# EAGLE design analyzer (EAGLE 6.5.0)
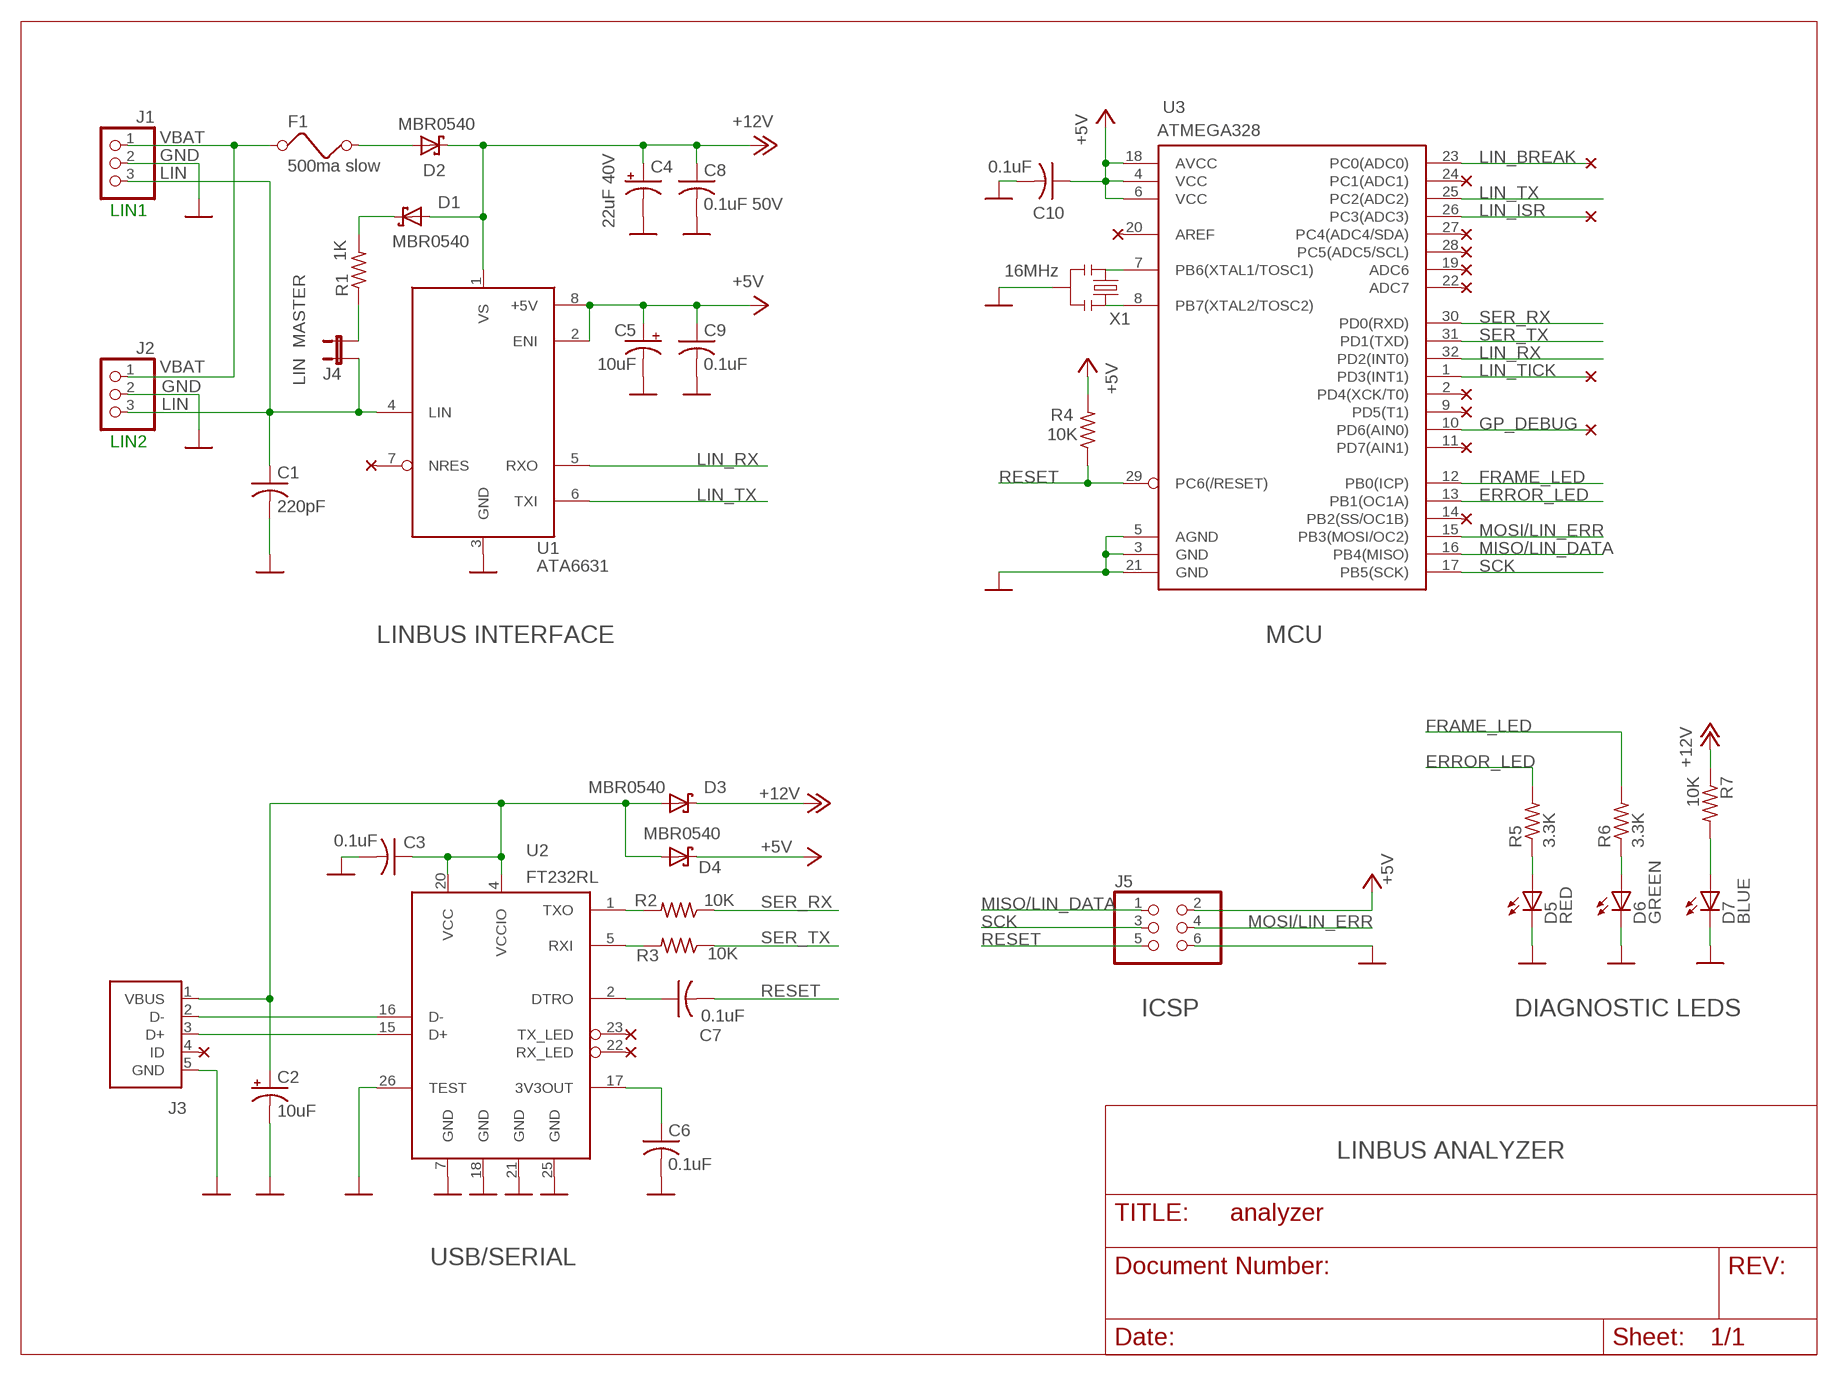
[diagram p0: schematic, sheet 1]

## Parts
C1  220pF  C-USC0805  [C0805]
C2  10uF  CPOL-USA/3216-18R  [A/3216-18R]
C3  0.1uF  C-USC0805  [C0805]
C4  22uF 40V  CPOL-USUD-6,3X5,8  [UD-6,3X5,8_NICHICON]
C5  10uF  CPOL-USA/3216-18R  [A/3216-18R]
C6  0.1uF  C-USC0805  [C0805]
C7  0.1uF  C-USC0805  [C0805]
C8  0.1uF 50V  C-USC0805  [C0805]
C9  0.1uF  C-USC0805  [C0805]
C10  0.1uF  C-USC0805  [C0805]
D1  MBR0540  SMF5.0AT1  [SOD123FL]
D2  MBR0540  SMF5.0AT1  [SOD123FL]
D3  MBR0540  SMF5.0AT1  [SOD123FL]
D4  MBR0540  SMF5.0AT1  [SOD123FL]
D5  RED  LED  [1206-LED]
D6  GREEN  LED  [1206-LED]
D7  BLUE  LED  [1206-LED]
F1  500ma slow  FUSE  [1206]
J1  PINHD-1X3  [1X03]
J2  PINHD-1X3  [1X03]
J3  USBSMD  [USB-MINIB]
J4  JP1E  [JP1]
J5  PINHD-2X3  [2X03]
R1  1K  R-US_R0805  [R0805]
R2  10K  R-US_R0805  [R0805]
R3  10K  R-US_R0805  [R0805]
R4  10K  R-US_R0805  [R0805]
R5  3.3K  R-US_R0805  [R0805]
R6  3.3K  R-US_R0805  [R0805]
R7  10K  R-US_R0805  [R0805]
U1  ATA6631  [SO-08]
U2  FT232RL  [SSOP28DB]
U3  ATMEGA328  [TQFP32-08]
X1  16MHz  RESONATORSMD  [RESONATOR-SMD]

## Nets
+5V: C5.+ C9.1 C10.1 D4.C J5.2 R4.2 U1.2(ENI) U1.8(+5V) U3.4(VCC) U3.6(VCC) U3.18(AVCC)
+12V: C4.+ C8.1 D1.A D2.C D3.C R7.1 U1.1(VS)
ERROR_LED: R5.2 U3.13(PB1(OC1A))
FRAME_LED: R6.2 U3.12(PB0(ICP))
GND: C1.2 C2.- C3.2 C4.- C5.- C6.2 C8.2 C9.2 C10.2 D5.C D6.C D7.C J1.2 J2.2 J3.5(GND) J5.6 U1.3(GND) U2.7(GND) U2.18(GND) U2.21(GND) U2.25(GND) U2.26(TEST) U3.3(GND) U3.5(AGND) U3.21(GND) X1.2
GP_DEBUG: U3.10(PD6(AIN0))
LIN: C1.1 J1.3 J2.3 J4.1 U1.4(LIN)
LIN_BREAK: U3.23(PC0(ADC0))
LIN_ISR: U3.26(PC3(ADC3))
LIN_RX: U1.5(RXO) U3.32(PD2(INT0))
LIN_TICK: U3.1(PD3(INT1))
LIN_TX: U1.6(TXI) U3.25(PC2(ADC2))
MISO/LIN_DATA: J5.1 U3.16(PB4(MISO))
MOSI/LIN_ERR: J5.4 U3.15(PB3(MOSI/OC2))
N$2: U3.8(PB7(XTAL2/TOSC2)) X1.1
N$3: D6.A R6.1
N$4: D5.A R5.1
N$5: R3.2 U2.5(RXI)
N$6: D2.A F1.2
N$7: U3.7(PB6(XTAL1/TOSC1)) X1.3
N$8: D1.C R1.2
N$9: J4.2 R1.1
N$10: J3.3(D+) U2.15(D+)
N$11: C7.1 U2.2(DTRO)
N$12: C2.+ C3.1 D3.A D4.A J3.1(VBUS) U2.4(VCCIO) U2.20(VCC)
N$13: R2.2 U2.1(TXO)
N$15: J3.2(D-) U2.16(D-)
N$16: C6.1 U2.17(3V3OUT)
N$17: D7.A R7.2
RESET: C7.2 J5.5 R4.1 U3.29(PC6(/RESET))
SCK: J5.3 U3.17(PB5(SCK))
SER_RX: R2.1 U3.30(PD0(RXD))
SER_TX: R3.1 U3.31(PD1(TXD))
VBAT: F1.1 J1.1 J2.1
Unconnected: J3.4(ID) U1.7(NRES) U2.22(RX_LED) U2.23(TX_LED) U3.2(PD4(XCK/T0)) U3.9(PD5(T1)) U3.11(PD7(AIN1)) U3.14(PB2(SS/OC1B)) U3.19(ADC6) U3.20(AREF) U3.22(ADC7) U3.24(PC1(ADC1)) U3.27(PC4(ADC4/SDA)) U3.28(PC5(ADC5/SCL))

## Notes on the sheet
- LIN1
- LIN  MASTER
- LIN2
- LINBUS INTERFACE | MCU
- ICSP | DIAGNOSTIC LEDS
- LINBUS ANALYZER
- USB/SERIAL

## Library data of the parts
C1 C3 C6-C10 = analyzer:C-US: CAPACITOR, American symbol
C2 C4 C5 = analyzer:CPOL-US
D1-D4 = analyzer:SMF5.0AT1
D5-D7 = analyzer:LED
F1 = analyzer:FUSE
J1 J2 = analyzer:PINHD-1X3
J3 = analyzer:USB: USB Connectors USB-B-PTH is fully proven SKU : PRT-00139 USB-miniB is fully proven SKU : PRT-00587 USB-A-PCB is untested. USB-A-H is throughly reviewed, but untested. Spark Fun Electronics SKU : PRT-00437 USB-B-SMT is throughly reviewed, but untested. Needs silkscreen touching up. USB-A-S has not been used/tested USB-MB-H has not been used/tested
J4 = analyzer:JP1E: JUMPER
J5 = analyzer:PINHD-2X3
R1-R7 = analyzer:R-US_: RESISTOR, American symbol
U1 = analyzer:ATA6631
U2 = analyzer:FT232RL
U3 = analyzer:ATMEGA328
X1 = analyzer:RESONATOR

## Net classes
1 power: width 0.254 mm

## Board
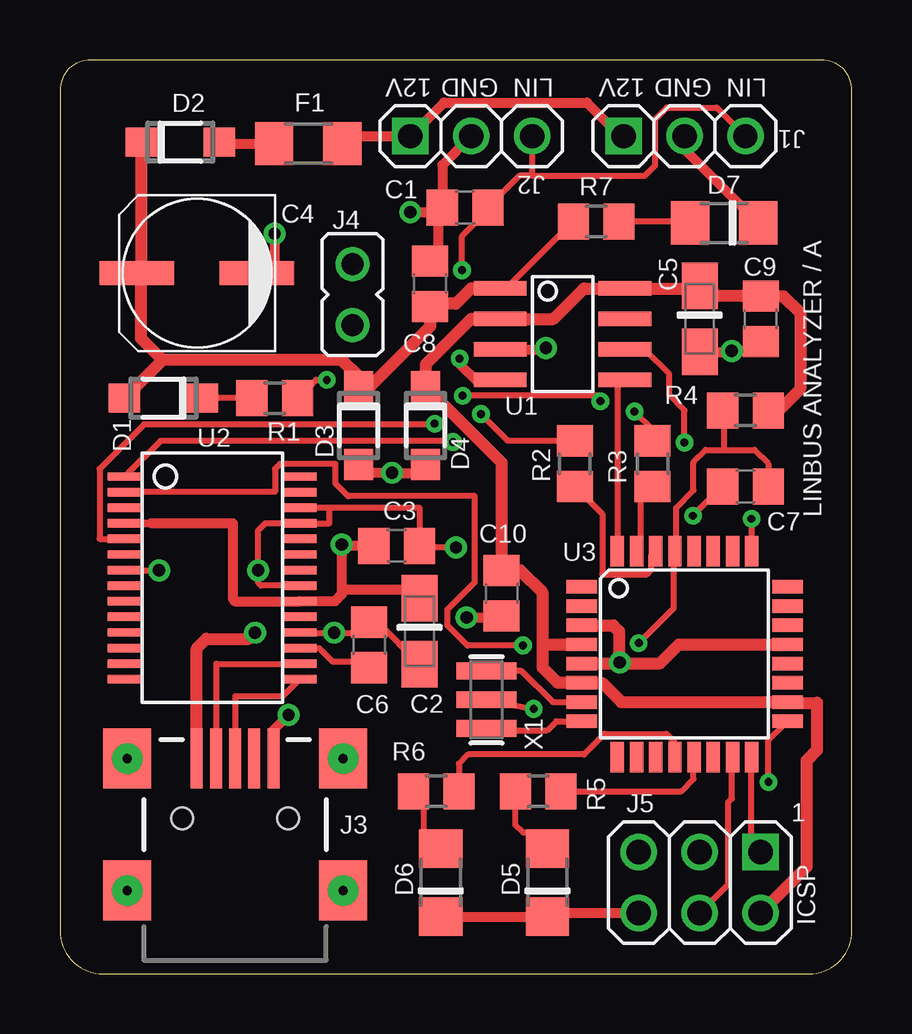
[diagram p1: board, top side]
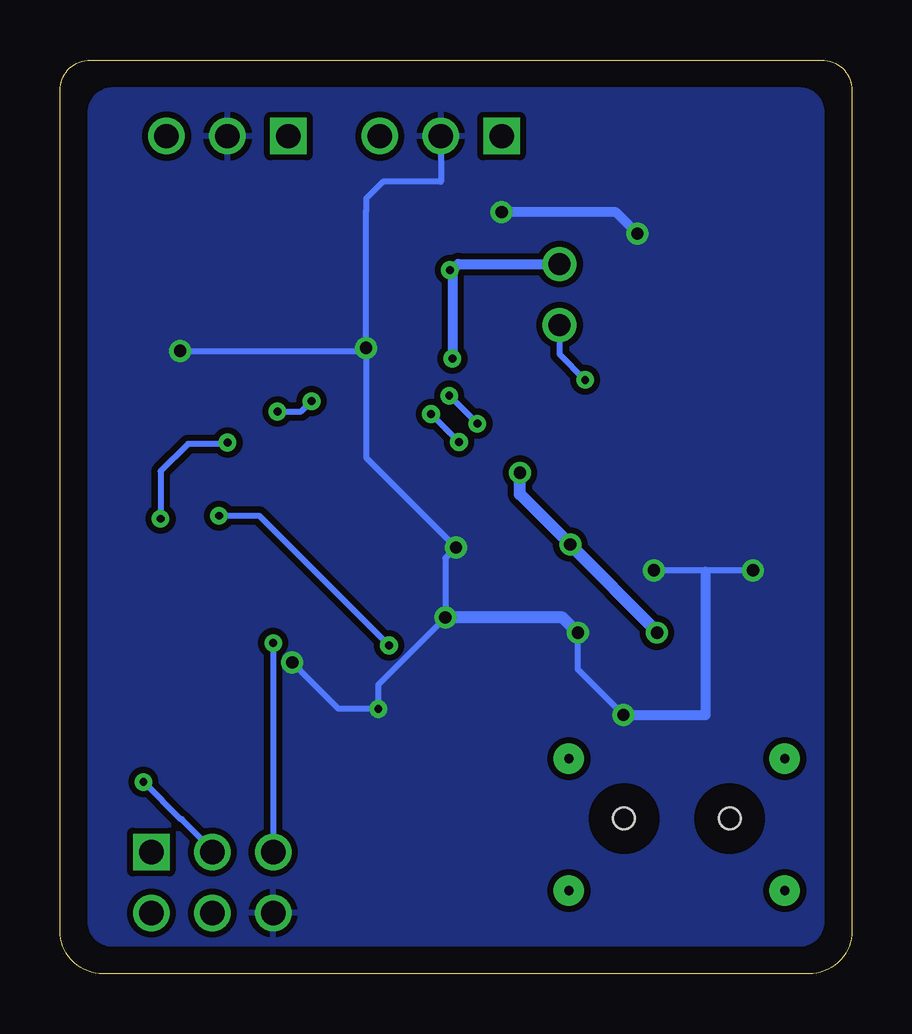
[diagram p2: board, bottom side, seen from below]

Size 33.02 x 38.1 mm. Coordinates in mm from the lower left corner, seen from the top.
Outline: 0,36.83 0,1.8 arc90 1.8,0 31.22,0 arc90 33.02,1.8 33.02,36.83 arc90 31.75,38.1 1.27,38.1 arc90 0,36.83
Copper layers (1*16): Top 0.035mm / dielectric 1.5mm / Bottom 0.035mm
Design rules "default *": minimum track width 10mil, minimum drill 13mil, track to track 8mil, track to pad 8mil, pad to pad 8mil, via to via 8mil, smd to smd 0mil, copper to edge 40mil, drill to drill 13mil, minimum pad ring 10mil, minimum via ring 8mil, stop-mask expansion 4mil, vias tented up to drill 20mil, thermal gap 10mil

### Footprints (pad centres in the part's own frame; a part is rotated, then mirrored left to right if it is on the bottom)
C0805 = smd 1.3 x 1.5: 1 -0.95,0; 2 0.95,0
A/3216-18R = smd 1.95 x 1.5: + 1.375,0; - -1.375,0
UD-6,3X5,8_NICHICON = smd 3.1 x 1: + 2.5,0; - -2.5,0
SOD123FL = smd 1.31 x 1.22: A 1.625,0; C -1.625,0
1206-LED = smd 1.6 x 1.803: A -1.422,0; C 1.422,0
1206 = smd 1.6 x 1.803: 1 -1.422,0; 2 1.422,0
1X03 = drill 1.016 square: 1 -2.54,0 | drill 1.016: 2 0,0; 3 2.54,0
USB-MINIB = smd 2.5 x 0.5: 1 2.5,1.6; 2 2.5,0.8; 3 2.5,0; 4 2.5,-0.8; 5 2.5,-1.6 | smd 2.5 x 2: MTN1 -3,4.5; MTN2 2.5,4.5; MTN3 -3,-4.5; MTN4 2.5,-4.5 | drill 0.381 pad 1.27: P$1 -3,4.5; P$2 -3,-4.5; P$3 2.5,4.5; P$4 2.5,-4.5 | hole 0.9: 0,2.2; 0,-2.2
JP1 = drill 0.914: 1 0,-1.27; 2 0,1.27
2X03 = drill 1.016 square: 1 -2.54,-1.27 | drill 1.016: 2 -2.54,1.27; 3 0,-1.27; 4 0,1.27; 5 2.54,-1.27; 6 2.54,1.27
R0805 = smd 1.3 x 1.5: 1 -0.95,0; 2 0.95,0
SO-08 = smd 0.6 x 2.2: 1 -1.905,-2.6; 2 -0.635,-2.6; 3 0.635,-2.6; 4 1.905,-2.6; 5 1.905,2.6; 6 0.635,2.6; 7 -0.635,2.6; 8 -1.905,2.6
SSOP28DB = smd 0.348 x 1.397: 1 -4.225,-3.656; 2 -3.575,-3.656; 3 -2.925,-3.656; 4 -2.275,-3.656; 5 -1.625,-3.656; 6 -0.975,-3.656; 7 -0.325,-3.656; 8 0.325,-3.656; 9 0.975,-3.656; 10 1.625,-3.656; 11 2.275,-3.656; 12 2.925,-3.656; 13 3.575,-3.656; 14 4.225,-3.656; 15 4.225,3.656; 16 3.575,3.656; 17 2.925,3.656; 18 2.275,3.656; 19 1.625,3.656; 20 0.975,3.656; 21 0.325,3.656; 22 -0.325,3.656; 23 -0.975,3.656; 24 -1.625,3.656; 25 -2.275,3.656; 26 -2.925,3.656; 27 -3.575,3.656; 28 -4.225,3.656
TQFP32-08 = smd 1.27 x 0.559: 1 -4.293,2.8; 2 -4.293,2; 3 -4.293,1.2; 4 -4.293,0.4; 5 -4.293,-0.4; 6 -4.293,-1.2; 7 -4.293,-2; 8 -4.293,-2.8; 17 4.293,-2.8; 18 4.293,-2; 19 4.293,-1.2; 20 4.293,-0.4; 21 4.293,0.4; 22 4.293,1.2; 23 4.293,2; 24 4.293,2.8 | smd 0.559 x 1.27: 9 -2.8,-4.293; 10 -2,-4.293; 11 -1.2,-4.293; 12 -0.4,-4.293; 13 0.4,-4.293; 14 1.2,-4.293; 15 2,-4.293; 16 2.8,-4.293; 25 2.8,4.293; 26 2,4.293; 27 1.2,4.293; 28 0.4,4.293; 29 -0.4,4.293; 30 -1.2,4.293; 31 -2,4.293; 32 -2.8,4.293
RESONATOR-SMD = smd 0.7 x 2.5: 1 -1.2,0; 2 0,0; 3 1.2,0

### Placement (x,y rotation side)
C1  16.89,31.94 180 top
C2  14.99,14.29 90 top
C3  14.03,17.84 0 top
C4  5.71,29.21 180 top
C5  26.67,27.3 90 top
C6  12.89,13.72 90 top
C7  28.57,20.32 0 top
C8  15.43,28.77 90 top
C9  29.21,27.3 270 top
C10  18.41,15.88 270 top
D1  4.32,24 180 top
D2  5.02,34.67 0 top
D3  12.45,22.86 270 top
D4  15.24,22.86 270 top
D5  20.32,3.81 270 top
D6  15.88,3.81 270 top
D7  27.69,31.31 0 top
F1  10.35,34.61 180 top
J1  26.04,34.92 0 top
J2  17.14,34.92 0 top
J3  7.3,6.48 90 top
J4  12.19,28.32 180 top
J5  26.67,3.81 180 top
R1  8.95,24 180 top
R2  21.46,21.27 90 top
R3  24.7,21.27 90 top
R4  28.57,23.5 0 top
R5  19.94,7.62 0 top
R6  15.68,7.62 0 top
R7  22.35,31.37 0 top
U1  20.95,26.67 270 top
U2  6.35,16.51 270 top
U3  26.04,13.34 0 top
X1  17.78,11.43 90 top

### Tracks (layer width: path | path; a pad name or v marks a point on that pad's centre or on a via)
+5V
  Top 0.406: 26.67,28.57 C5.+ 26.67,28.25 | 19.18,16.82 C10.1 | U3.4 21.72,13.72 | 29.97,23.5 R4.2
  Top 0.508: 26.67,28.57 U1.8 21.84,28.57 20.57,27.3 U1.2 17.14,27.3 15.24,25.4 D4.C 18.41,21.31 C10.1 | 26.67,28.25 C9.1 30.16,28.25 30.86,27.56 30.86,24.38 29.97,23.5 | 20.13,13.72 20.13,15.88 19.18,16.82 | 21.72,13.72 20.13,13.72 | 20.13,13.72 20.13,12.76 20.76,12.13 U3.6 21.75,12.13 22.61,12.13 23.4,11.34 U3.18 30.3,11.3 31.56,11.3 31.56,9.34 31.11,8.89 31.11,4.45 J5.2
+12V
  Top 0.254: R7.1 21.39,31.37 18.54,28.52 U1.1
  Top 0.406: 3.39,29.21 C4.+ 3.37,29.06 | 12.45,24.89 D3.C 12.93,24.48 | 15.55,27.94 C8.1
  Top 0.508: D2.C 3.39,29.21 | 3.37,29.06 3.37,26.51 4.28,25.59 | U1.1 17.14,28.57 16.51,27.94 15.55,27.94 | 12.45,24.89 11.75,25.59 4.28,25.59 | 4.28,25.59 D1.A | C8.1 15.43,26.99 12.93,24.48
ERROR_LED
  Top 0.254: R5.2 25.91,7.62 26.42,8.13 26.42,9.02 U3.13 26.42,9.04
FRAME_LED
  Top 0.254: U3.12 25.64,9.65 25.27,10.01 22.71,10.01 21.84,9.14 17.02,9.14 16.63,8.76 R6.2
GND  (via drill 0.33, 0.51)
  Top 0.254: X1.2 v19.75,11.05 | U2.26 11.24,19.43 | 11.24,19.43 14.98,19.43 C3.2 15.05,17.78 v16.51,17.78 | U2.25 11.24,18.79 11.24,19.43 | 18.35,14.86 C10.2 | U2.21 10,16.19 8.38,16.19 8.26,16.32 v8.26,16.83 8.26,18.48 8.57,18.8 9.97,18.8 | U2.7 2.7,16.83 v4.13,16.83 | C2.- 13.23,14.67 C6.2 12.45,14.22 v11.43,14.22 10.02,14.22 U2.18 | J3.5 8.9,10.17
  Top 0.406: D6.C D5.C 20.47,2.54 J5.6 | v16.95,14.86 18.35,14.86 | 8.9,10.17 v9.53,10.79 | J2.2 15.94,33.72 C1.2 15.75,31.75 | v8.95,30.86 8.95,29.21 C4.- | U1.3 20.19,26.04 v20.26,26.1 | v14.61,31.75 15.75,31.75 | 15.75,31.75 15.75,30.04 C8.2 | C5.- 27.96,25.93 v28,25.97 28.83,25.97 C9.2 | J1.2 26.04,34.38 D7.C
  Top 0.508: U3.5 21.76,12.95 23.18,12.95 | 23.18,12.95 23.37,12.95 | U3.3 23.06,14.54 23.3,14.29 23.3,13.02 v23.34,12.99 | v23.34,12.99 23.37,12.95 | v23.34,12.99 23.21,12.99 23.18,12.95 | 23.37,12.95 25.02,12.95 25.8,13.73 U3.21
  Bottom 0.254: v4.13,16.83 v8.26,16.83 | v9.53,10.79 11.43,12.7 v11.43,14.22 | v28,25.97 20.38,25.97 | v20.26,26.1 20.26,31.81 20.26,32.32 19.56,33.02 17.14,33.02 J2.2 | v23.34,12.99 21.4,11.05 v19.75,11.05 19.75,12.06 v16.95,14.86 16.95,17.34 v16.51,17.78 20.26,21.53 20.26,26.04
  Bottom 0.406: v8.95,30.86 9.84,31.75 v14.61,31.75 | 20.38,25.97 v20.26,26.1 | 9.58,10.79 6.1,10.79 6.1,16.76
  Bottom 0.508: v11.43,14.22 12.06,14.86 v16.95,14.86
  pour Bottom (isolate 0.254): 2.17,36.83 30.83,36.83 arc-90 31.75,35.91 31.75,2.17 arc-90 30.85,1.27 2.17,1.27 arc-90 1.27,2.17 1.27,35.93 arc-90
LIN  (via drill 0.33)
  Top 0.254: J1.3 27.38,36.12 25.3,36.12 24.82,35.64 24.82,33.71 24.38,33.27 19.68,33.27 | 18.34,24.77 U1.4 | v16.76,29.34 16.76,30.76 17.75,31.75 C1.1 18.26,32.36 18.26,32.38 19.15,33.27 19.68,33.27 | J2.3 19.68,33.27
  Top 0.406: v16.66,25.65 16.66,25.43 17.4,24.69 18.28,24.69 U1.4
  Bottom 0.406: v16.76,29.34 16.66,29.34 | 16.66,29.34 v16.66,25.65 | 16.66,29.34 16.41,29.59 J4.1
LIN_RX
  Top 0.254: U3.32 23.24,24.46 U1.5
LIN_TX  (via drill 0.33)
  Top 0.254: v28.83,18.97 U3.25 | U1.6 24.38,26.04 25.4,25.02 25.4,24.13 26.04,23.5 v26.04,22.15
  Bottom 0.254: v26.04,22.15 26.09,22.1 27.69,22.1 28.83,20.95 v28.83,18.97
MISO/LIN_DATA
  Top 0.254: J5.1 28.83,5.46 U3.16
MOSI/LIN_ERR
  Top 0.254: J5.4 27.86,3.73 27.86,7.16 28.02,7.32 28.02,9.02 U3.15 28.02,9.04
N$2
  Top 0.254: X1.1 18.48,10.16 20.32,10.16 20.7,10.54 U3.8
N$3
  Top 0.254: R6.1 14.76,7.62 15.16,7.21 15.16,5.59 15.52,5.23 D6.A
N$4
  Top 0.254: R5.1 18.97,7.61 18.97,6.22 19.3,5.89 19.66,5.89 D5.A
N$5  (via drill 0.33)
  Top 0.254: v15.62,22.94 15.62,22.91 3.5,22.91 1.65,21.06 1.65,18.14 U2.5 | v16.79,24.11 22.53,24.11 v22.53,23.88 | v23.95,23.44 24.69,22.71 R3.2
  Bottom 0.254: v16.79,24.11 v15.62,22.94 | v22.53,23.88 22.96,23.44 v23.95,23.44
N$6
  Top 0.406: D2.A 6.64,34.61 F1.2
N$7
  Top 0.254: 21.71,11.3 U3.7 20.54,11.34 19.25,12.63 X1.3 18.54,12.51 18.6,12.57
N$8
  Top 0.254: R1.2 D1.C
N$9  (via drill 0.33)
  Top 0.254: v11.12,24.77 10.67,24.77 R1.1
  Bottom 0.254: v11.12,24.77 12.19,25.83 J4.2
N$10
  Top 0.254: U2.15 9.98,12.27 9.3,11.58 7.32,11.58 7.32,8.99 J3.3
N$11  (via drill 0.33)
  Top 0.254: v19.3,13.69 16.99,13.69 16.15,14.53 16.15,15.19 17.3,16.33 17.3,19.91 12.01,19.91 11.48,20.45 11.48,21.26 9.17,21.26 8.97,21.06 8.97,20.09 2.72,20.09 U2.2 | v26.39,19.1 C7.1
  Bottom 0.254: v19.3,13.69 24.71,19.1 v26.39,19.1
N$12  (via drill 0.51)
  Top 0.254: U2.20 10.05,15.49 | 11.75,17.84 v11.75,17.91 | 14.9,20.89 D4.A | 12.79,20.89 D3.A | C2.+ 14.65,16 | 2.72,18.77 U2.4 | 7.21,15.65 7.28,15.54
  Top 0.305: 2.72,18.77 3.81,18.77 3.81,18.8
  Top 0.406: 7.28,15.54 U2.20 11.47,15.54 11.75,15.81 11.75,16 | C3.1 11.75,17.84 11.75,16 | 14.9,20.89 v13.84,20.89 12.79,20.89 | 14.65,16 11.75,16 | 7.21,15.65 7.21,18.8 3.81,18.8
  Top 0.508: J3.1 5.7,13.58 6.1,13.97 7.87,13.97 v8.13,14.22
  Bottom 0.406: v8.13,14.22 8.13,14.29
  Bottom 0.508: 8.13,14.29 v11.75,17.91 13.84,20 v13.84,20.89
N$13  (via drill 0.33)
  Top 0.254: v16.38,22.17 16.38,22.23 4.19,22.23 2.72,20.75 U2.1 | v17.55,23.34 18.67,22.23 R2.2
  Bottom 0.254: v17.55,23.34 v16.38,22.17
N$15
  Top 0.254: U2.16 9.98,12.93 6.53,12.93 6.53,8.99 J3.2
N$16
  Top 0.254: U2.17 10.8,13.59 11.37,13.02 12.64,13.02 C6.1
N$17
  Top 0.254: R7.2 26.26,31.37 D7.A
RESET  (via drill 0.33)
  Top 0.254: R4.1 27.69,23.42 27.69,21.84 | C7.2 29.52,21.27 28.96,21.84 27.69,21.84 | v24.13,13.79 25.58,15.24 25.58,17.53 U3.29 25.65,17.63 25.68,17.65 25.68,19.43 26.42,20.17 26.42,21.34 26.92,21.84 27.69,21.84
  Bottom 0.254: v24.13,13.79 J5.5
SCK  (via drill 0.33)
  Top 0.254: v29.54,8 29.54,9.73 30.33,10.52 U3.17
  Bottom 0.254: v29.54,8 27.99,6.45 27.94,6.45 26.67,5.18 J5.3
SER_RX
  Top 0.254: U3.30 24.82,17.63 24.66,17.48 24.66,16.87 24.46,16.66 22.61,16.66 22.61,19.18 R2.1
SER_TX
  Top 0.254: U3.31 24.05,17.63 24.21,17.78 24.21,19.84 R3.1
VBAT
  Top 0.406: F1.1 11.77,34.92 J2.1 16,36.32 21.97,36.32 23.37,34.92 J1.1

### Text on the board
tPlace: 12V | GND | LIN | 12V | GND | LIN | LINBUS ANALYZER / A | 1 | ICSP